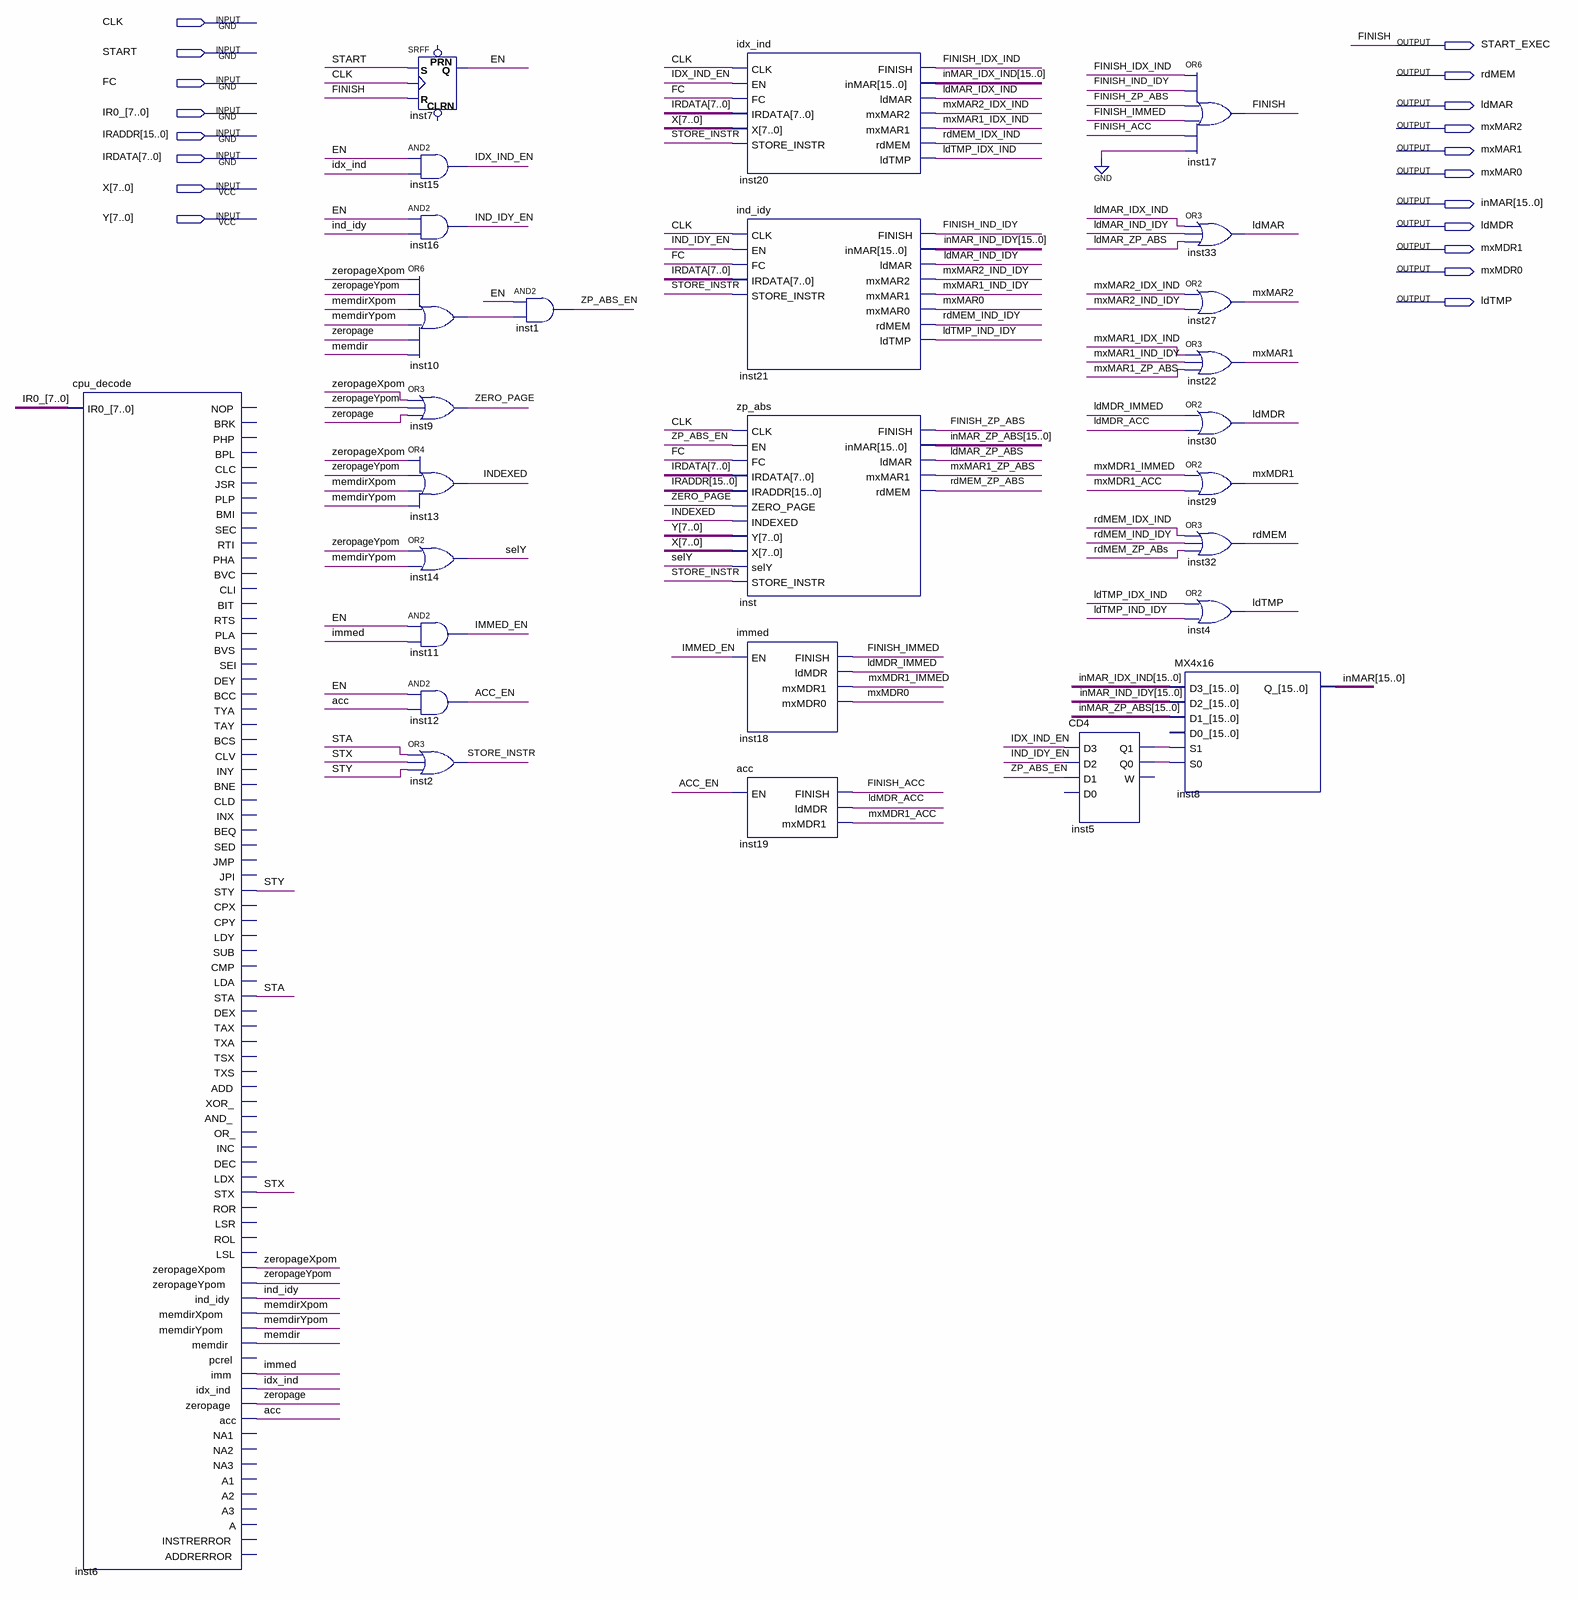
[diagram p0: schematic sheet]
// Quartus schematic cpu_addr.bdf as structural Verilog: 27 symbols, 19 pins
module cpu_addr (
  input  CLK,
  input  START,
  input  FC,
  input  [7:0] IR0_,
  input  [15:0] IRADDR,
  input  [7:0] IRDATA,
  input  [7:0] X,
  input  [7:0] Y,
  output START_EXEC,
  output rdMEM,
  output ldMAR,
  output mxMAR2,
  output mxMAR1,
  output mxMAR0,
  output [15:0] inMAR,
  output ldMDR,
  output mxMDR1,
  output mxMDR0,
  output ldTMP
);

  wire acc, ACC_EN, EN, FINISH_ACC, FINISH_IDX_IND, FINISH_IMMED, FINISH_IND_IDY, FINISH_ZP_ABS, idx_ind,
       IDX_IND_EN, immed, IMMED_EN, ind_idy, IND_IDY_EN, INDEXED, inst5_q0, inst5_q1, inst10_out,
       ldMAR_IDX_IND, ldMAR_IND_IDY, ldMAR_ZP_ABS, ldMDR_ACC, ldMDR_IMMED, ldTMP_IDX_IND, ldTMP_IND_IDY,
       memdir, memdirXpom, memdirYpom, mxMAR1_IDX_IND, mxMAR1_IND_IDY, mxMAR1_ZP_ABS, mxMAR2_IDX_IND,
       mxMAR2_IND_IDY, mxMDR1_ACC, mxMDR1_IMMED, rdMEM_IDX_IND, rdMEM_IND_IDY, rdMEM_ZP_ABs, selY, STA,
       STORE_INSTR, STX, STY, ZERO_PAGE, zeropage, zeropageXpom, zeropageYpom, ZP_ABS_EN;
  wire [15:0] inMAR_IDX_IND, inMAR_IND_IDY, inMAR_ZP_ABS;

  cpu_decode inst6 (
    .IR0_(IR0_), .STY(STY), .STA(STA), .STX(STX), .zeropageXpom(zeropageXpom), .zeropageYpom(zeropageYpom),
    .ind_idy(ind_idy), .memdirXpom(memdirXpom), .memdirYpom(memdirYpom), .memdir(memdir), .imm(immed),
    .idx_ind(idx_ind), .zeropage(zeropage), .acc(acc));  // open: NOP, BRK, PHP, BPL, CLC, JSR, PLP, BMI, SEC, RTI, PHA, BVC, CLI, BIT, RTS, PLA, BVS, SEI, DEY, BCC, TYA, TAY, BCS, CLV, INY, BNE, CLD, INX, BEQ, SED, JMP, JPI, CPX, CPY, LDY, SUB, CMP, LDA, DEX, TAX, TXA, TSX, TXS, ADD, XOR_, AND_, OR_, INC, DEC, LDX, ROR, LSR, ROL, LSL, pcrel, NA1, NA2, NA3, A1, A2, A3, A, INSTRERROR, ADDRERROR
  SRFF inst7 (.S(START), .R(START_EXEC), .CLK(CLK), .Q(EN));  // open: PRN, CLRN
  and inst15 (IDX_IND_EN, EN, idx_ind);
  and inst16 (IND_IDY_EN, EN, ind_idy);
  or inst10 (inst10_out, zeropageXpom, zeropageYpom, memdirXpom, memdirYpom, zeropage, memdir);
  or inst9 (ZERO_PAGE, zeropageXpom, zeropageYpom, zeropage);
  or inst13 (INDEXED, zeropageXpom, zeropageYpom, memdirXpom, memdirYpom);
  or inst14 (selY, zeropageYpom, memdirYpom);
  and inst11 (IMMED_EN, EN, immed);
  and inst12 (ACC_EN, EN, acc);
  or inst2 (STORE_INSTR, STA, STX, STY);
  and inst1 (ZP_ABS_EN, EN, inst10_out);
  idx_ind inst20 (
    .CLK(CLK), .EN(IDX_IND_EN), .FC(FC), .IRDATA(IRDATA), .X(X), .STORE_INSTR(STORE_INSTR),
    .FINISH(FINISH_IDX_IND), .inMAR(inMAR_IDX_IND), .ldMAR(ldMAR_IDX_IND), .mxMAR2(mxMAR2_IDX_IND),
    .mxMAR1(mxMAR1_IDX_IND), .rdMEM(rdMEM_IDX_IND), .ldTMP(ldTMP_IDX_IND));
  ind_idy inst21 (
    .CLK(CLK), .EN(IND_IDY_EN), .FC(FC), .IRDATA(IRDATA), .STORE_INSTR(STORE_INSTR), .FINISH(FINISH_IND_IDY),
    .inMAR(inMAR_IND_IDY), .ldMAR(ldMAR_IND_IDY), .mxMAR2(mxMAR2_IND_IDY), .mxMAR1(mxMAR1_IND_IDY),
    .mxMAR0(mxMAR0), .rdMEM(rdMEM_IND_IDY), .ldTMP(ldTMP_IND_IDY));
  zp_abs inst (
    .CLK(CLK), .EN(ZP_ABS_EN), .FC(FC), .IRDATA(IRDATA), .IRADDR(IRADDR), .ZERO_PAGE(ZERO_PAGE),
    .INDEXED(INDEXED), .Y(Y), .X(X), .selY(selY), .STORE_INSTR(STORE_INSTR), .FINISH(FINISH_ZP_ABS),
    .inMAR(inMAR_ZP_ABS), .ldMAR(ldMAR_ZP_ABS), .mxMAR1(mxMAR1_ZP_ABS), .rdMEM(rdMEM_ZP_ABs));
  immed inst18 (.EN(IMMED_EN), .FINISH(FINISH_IMMED), .ldMDR(ldMDR_IMMED), .mxMDR1(mxMDR1_IMMED), .mxMDR0(mxMDR0));
  acc inst19 (.EN(ACC_EN), .FINISH(FINISH_ACC), .ldMDR(ldMDR_ACC), .mxMDR1(mxMDR1_ACC));
  CD4 inst5 (.D3(IDX_IND_EN), .D2(IND_IDY_EN), .D1(ZP_ABS_EN), .Q1(inst5_q1), .Q0(inst5_q0));  // open: D0, W
  or inst17 (START_EXEC, FINISH_IDX_IND, FINISH_IND_IDY, FINISH_ZP_ABS, FINISH_IMMED, FINISH_ACC, 1'b0);
  or inst33 (ldMAR, ldMAR_IDX_IND, ldMAR_IND_IDY, ldMAR_ZP_ABS);
  or inst27 (mxMAR2, mxMAR2_IDX_IND, mxMAR2_IND_IDY);
  or inst22 (mxMAR1, mxMAR1_IDX_IND, mxMAR1_IND_IDY, mxMAR1_ZP_ABS);
  or inst30 (ldMDR, ldMDR_IMMED, ldMDR_ACC);
  or inst29 (mxMDR1, mxMDR1_IMMED, mxMDR1_ACC);
  or inst32 (rdMEM, rdMEM_IDX_IND, rdMEM_IND_IDY, rdMEM_ZP_ABs);
  or inst4 (ldTMP, ldTMP_IDX_IND, ldTMP_IND_IDY);
  MX4x16 inst8 (
    .D3_(inMAR_IDX_IND), .D2_(inMAR_IND_IDY), .D1_(inMAR_ZP_ABS), .S1(inst5_q1), .S0(inst5_q0), .Q_(inMAR));  // open: D0_

  // Other names for the same wires on the sheet: FINISH = START_EXEC
endmodule
